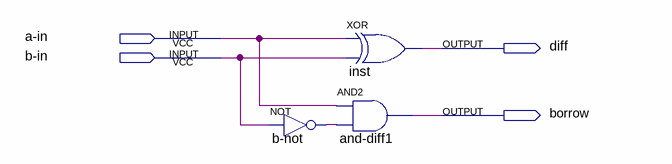
[diagram p0: schematic sheet]
// Quartus schematic halfSubtractor.bdf as structural Verilog: 3 symbols, 4 pins
module halfSubtractor (
  input  \a-in ,
  input  \b-in ,
  output diff,
  output borrow
);

  wire b_not_out;

  not \b-not  (b_not_out, \b-in );
  xor inst (diff, \a-in , \b-in );
  and \and-diff1  (borrow, \a-in , b_not_out);
endmodule
